# EAGLE design RGBLED (EAGLE 6.6.0)
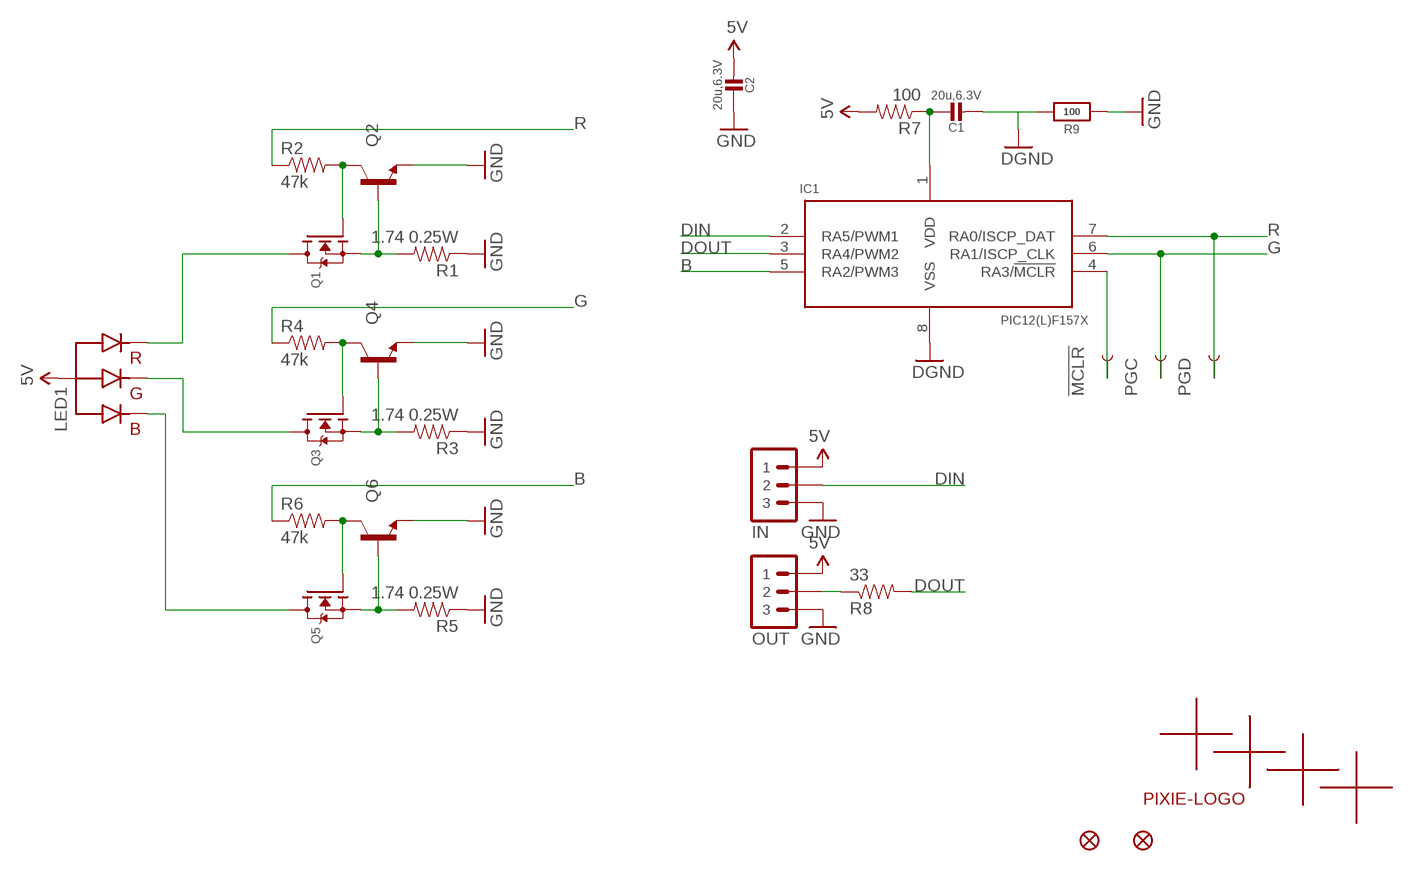
[diagram p0: schematic, sheet 1]

## Parts
!MCLR  TEST-POINT3X4  [PAD.03X.04]
C1  20u,6.3V  CAP_CERAMIC_0805MP  [_0805MP]
C2  20u,6.3V  CAP_CERAMIC_0805MP  [_0805MP]
IC1  PIC12(L)F157X  [MSOP-8]
IN  M030.1PWR+SIG  [1X03-0.1PWR+SIG]
LED1  RGBLED_CA  [RGBLED3W4PIN]
OUT  M030.1PWR+SIG  [1X03-0.1PWR+SIG]
PGC  TEST-POINT3X4  [PAD.03X.04]
PGD  TEST-POINT3X4  [PAD.03X.04]
Q1  IRLML2060TRPBF  [SOT23-3]
Q2  MMBT2222A  [SOT23-3]
Q3  IRLML2060TRPBF  [SOT23-3]
Q4  MMBT2222A  [SOT23-3]
Q5  IRLML2060TRPBF  [SOT23-3]
Q6  MMBT2222A  [SOT23-3]
R1  1.74 0.25W  RESISTOR1206  [1206]
R2  47k  RESISTOR0603  [0603-RES]
R3  1.74 0.25W  RESISTOR1206  [1206]
R4  47k  RESISTOR0603  [0603-RES]
R5  1.74 0.25W  RESISTOR1206  [1206]
R6  47k  RESISTOR0603  [0603-RES]
R7  100  RESISTOR0603  [0603-RES]
R8  33  RESISTOR0603  [0603-RES]
R9  100  RESISTOR_0603MP  [_0603MP]
U$1  ALIGN_CROSS  [ALIGN_CROSS]
U$2  ALIGN_CROSS  [ALIGN_CROSS]
U$3  ALIGN_CROSS  [ALIGN_CROSS]
U$4  ALIGN_CROSS  [ALIGN_CROSS]
U$5  PIXIE-LOGO  [PIXIE-LOGO]
U$6  FIDUCIAL""  [FIDUCIAL_1MM]
U$7  FIDUCIAL""  [FIDUCIAL_1MM]

## Nets
5V: C2.2 IN.P$1 LED1.ANODE(VCC) OUT.P$1 R7.2
B: IC1.5(RA2/PWM3) R6.1
DGND: C1.2 IC1.8(VSS) R9.2
DIN: IC1.2(RA5/PWM1) IN.P$2
DOUT: IC1.3(RA4/PWM2) R8.2
G: IC1.6(RA1/ISCP_CLK) PGC.P$1 R4.1
GND: C2.1 IN.P$3 OUT.P$3 Q2.2(E) Q4.2(E) Q6.2(E) R1.1 R3.1 R5.1 R9.1
N$1: LED1.R(RED) Q1.3(D)
N$2: LED1.G(GREEN) Q3.3(D)
N$3: LED1.B(BLUE) Q5.3(D)
N$4: Q1.2(S) Q2.1(B) R1.2
N$6: Q3.2(S) Q4.1(B) R3.2
N$8: OUT.P$2 R8.1
N$10: !MCLR.P$1 IC1.4(RA3/!MCLR)
N$11: Q5.1(G) Q6.3(C) R6.2
N$12: Q3.1(G) Q4.3(C) R4.2
N$13: C1.1 IC1.1(VDD) R7.1
N$15: Q5.2(S) Q6.1(B) R5.2
N$17: Q1.1(G) Q2.3(C) R2.2
R: IC1.7(RA0/ISCP_DAT) PGD.P$1 R2.1

## Library data of the parts
!MCLR PGC PGD = SparkFun-Passives:TEST-POINT: Bare copper test points for troubleshooting or ICT
C1 C2 = microbuilder:CAP_CERAMIC: Ceramic Capacitors For new designs, use the packages preceded by an '_' character since they are more reliable: The following footprints should be used on most boards: _0402 - Standard footprint for regular board layouts _0603 - Standard footprint for regular board layouts _0805 - Standard footprint for regular board layouts _1206 - Standard footprint for regular board layouts For extremely tight-pitch boards where space is at a premium, the following 'micro-pitch' footprints can be used (smaller pads, no silkscreen outline, etc.): _0402MP - Micro-pitch footprint for very dense/compact boards _0603MP - Micro-pitch footprint for very dense/compact boards _0805MP - Micro-pitch footprint for very dense/compact boards _1206MP - Micro-pitch footprint for very dense/compact boards
IC1 = microbuilder:PIC12(L)F157X
IN OUT = RGBLED:M03: Header 3 Standard 3-pin 0.1" header. Use with straight break away headers (SKU : PRT-00116), right angle break away headers (PRT-00553), swiss pins (PRT-00743), machine pins (PRT-00117), and female headers (PRT-00115). Molex polarized connector foot print use with SKU : PRT-08232 with associated crimp pins and housings.
LED1 = microbuilder:RGBLED_CA: RGB LED, common-anode 5MM Staggered pins 5mm Piranha package http://www.ladyada.net/library/pcb/eaglelibrary.html
Q1 Q3 Q5 = Parts:IRLML2060TRPBF
Q2 Q4 Q6 = Parts:MMBT2222A
R1 R3 R5 = SparkFun-Resistors:RESISTOR: Resistor Basic schematic elements and footprints for 0603, 1206, and PTH resistors.
R2 R4 R6-R8 = RGBLED:RESISTOR: Resistor Basic schematic elements and footprints for 0603, 1206, and PTH resistors.
R9 = microbuilder:RESISTOR: Resistors For new designs, use the packages preceded by an '_' character since they are more reliable: The following footprints should be used on most boards: _0402 - Standard footprint for regular board layouts _0603 - Standard footprint for regular board layouts _0805 - Standard footprint for regular board layouts _1206 - Standard footprint for regular board layouts For extremely tight-pitch boards where space is at a premium, the following 'micro-pitch' footprints can be used (smaller pads, no silkscreen outline, etc.): _0402MP - Micro-pitch footprint for very dense/compact boards _0603MP - Micro-pitch footprint for very dense/compact boards _0805MP - Micro-pitch footprint for very dense/compact boards _1206MP - Micro-pitch footprint for very dense/compact boards
U$1-U$4 = Parts:ALIGN_CROSS
U$5 = microbuilder:PIXIE-LOGO
U$6 U$7 = microbuilder:FIDUCIAL: Fiducial Alignment Points Various fiducial points for machine vision alignment.; BOM: EXCLUDE

## Board
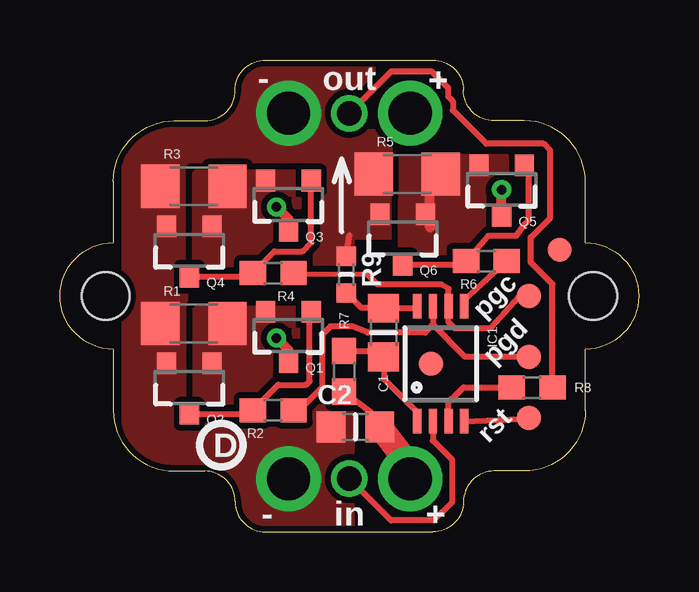
[diagram p1: board, top side]
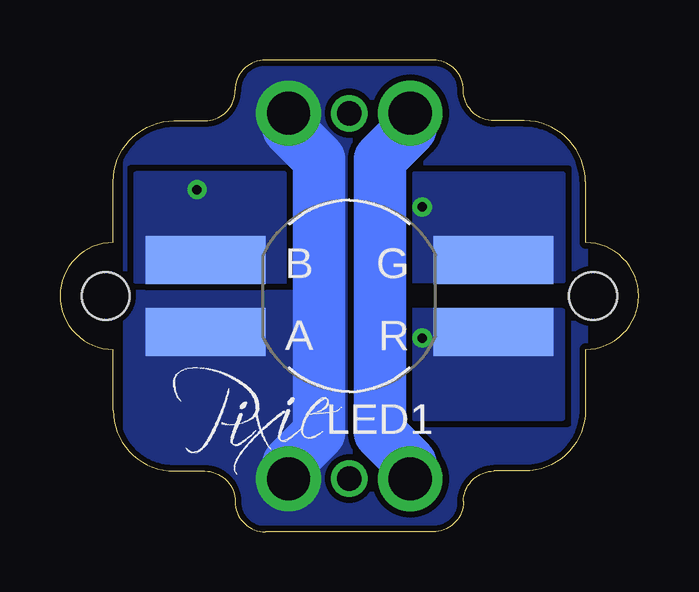
[diagram p2: board, bottom side, seen from below]

Size 24.13 x 19.69 mm. Coordinates in mm from the lower left corner, seen from the top.
Outline: 16.83,1.27 arc-90 15.56,0 8.57,0 arc-90 7.3,1.27 arc90 6.03,2.54 4.76,2.54 arc-90 2.22,5.08 2.22,7.62 arc-180 2.22,12.07 2.22,14.6 arc-90 4.76,17.14 6.03,17.14 arc90 7.3,18.42 arc-90 8.57,19.69 15.56,19.69 arc-90 16.83,18.42 arc90 18.1,17.14 19.37,17.14 arc-90 21.91,14.6 21.91,12.07 arc-180 21.91,7.62 21.91,5.08 arc-90 19.37,2.54 18.1,2.54 arc90 16.83,1.27
Copper layers (1*16): Top 0.035mm / dielectric 1.5mm / Bottom 0.035mm
Design rules "adafruit *": minimum track width 10mil, minimum drill 15.5mil, track to track 10mil, track to pad 10mil, pad to pad 10mil, via to via 10mil, smd to smd 8mil, copper to edge 10mil, drill to drill 8mil, minimum pad ring 10mil, minimum via ring 8mil, stop-mask expansion 2mil, vias tented up to drill 20mil, thermal gap 10mil
Holes 2 mm at 1.91,9.84 22.23,9.84

### Footprints (pad centres in the part's own frame; a part is rotated, then mirrored left to right if it is on the bottom)
PAD.03X.04 = smd 1.016 x 1.016: P$1 0,0
_0805MP = smd 1.2 x 1.3: 1 -1.016,0; 2 1.016,0
MSOP-8 = smd 0.35 x 1.02: 1 -0.975,-2.4; 2 -0.325,-2.4; 3 0.325,-2.4; 4 0.975,-2.4; 5 0.975,2.4; 6 0.325,2.4; 7 -0.325,2.4; 8 -0.975,2.4
1X03-0.1PWR+SIG = drill 1.8: P$1 -2.54,0; P$3 2.54,0 | drill 1.016: P$2 0,0
RGBLED3W4PIN = smd 5 x 2: ANODE 6,1.5; B 6,-1.5; G -6,-1.5; R -6,1.5
SOT23-3 = smd 0.8 x 0.9: 1 -0.95,-1; 2 0.95,-1; 3 0,1.1
1206 = smd 1.6 x 1.8: 1 -1.4,0; 2 1.4,0
0603-RES = smd 1.1 x 1: 1 -0.85,0; 2 0.85,0
_0603MP = smd 0.8 x 0.8: 1 -0.762,0; 2 0.762,0
FIDUCIAL_1MM = smd 1 x 1: 1 0,0

### Placement (x,y rotation side)
!MCLR  19.56,4.76 0 top
C1  13.49,8.32 90 top
C2  12.32,4.38 0 top
IC1  15.88,7.02 0 top
IN  12.06,2.22 180 top
LED1  12.06,9.84 180 bottom
OUT  12.06,17.46 180 top
PGC  19.56,9.84 0 top
PGD  19.56,7.3 0 top
Q1  9.53,8.19 180 top
Q2  5.4,6.03 180 top
Q3  9.53,13.65 180 top
Q4  5.4,11.75 180 top
Q5  18.42,14.29 180 top
Q6  14.29,12.26 180 top
R1  5.59,8.7 0 top
R2  8.89,5.08 180 top
R3  5.59,14.41 0 top
R4  8.89,10.79 180 top
R5  14.48,14.92 0 top
R6  17.78,11.3 180 top
R7  11.84,6.7 270 top
R8  19.69,6.03 180 top
R9  11.94,10.73 270 top
U$1  2.22,19.69 0 top
U$2  21.91,19.69 0 top
U$3  2.22,0 0 top
U$4  21.91,0 0 top
U$5  18.65,3.4 5 bottom
U$6  15.47,7.02 0 top
U$7  20.83,11.77 0 top
U$8  [PCBFEAT-REV-040]  6.73,3.62 0 top

### Tracks (layer width: path | path; a pad name or v marks a point on that pad's centre or on a via)
5V
  Top 0.254: C2.2 12.96,4.98 R7.2
  Top 1.016: C2.2 14.6,2.74 IN.P$1
  Bottom 2.184: IN.P$1 14.6,2.86 13.33,4.13 13.33,15.56 14.6,16.83 OUT.P$1
  pour Bottom (rank 6, no thermals): 2.22,19.69 21.4,19.69 21.4,0 2.22,0
B
  Top 0.254: IC1.5 16.85,9.65 R6.1
DGND
  Top 0.254: 14.88,9.52 IC1.8 14.9,9.35 C1.2 12.57,9.35 R9.2 11.94,9.82
DIN
  Top 0.254: IC1.2 15.55,3.82 16.34,3.02 16.34,1.24 15.58,0.48 13.8,0.48 IN.P$2
DOUT
  Top 0.254: IC1.3 16.2,5.41 16.83,6.03 R8.2
G
  Top 0.203: 12.83,10.73 9.8,10.73
  Top 0.254: PGC.P$1 19.18,9.84 17.96,8.5 16.46,8.5 16.19,8.76 16.19,9.54 IC1.6 16.2,10.15 15.9,10.33 13.23,10.33 12.83,10.73 | 9.74,10.77 R4.1 9.8,10.73
GND
  Top 0.254: R9.1 12.06,12.38
  Bottom 2.184: IN.P$3 9.53,2.86 10.79,4.13 10.79,15.56 9.53,16.83 OUT.P$3
  pour Top (rank 2, no thermals): 2.78,19.56 15.08,19.69 14.92,12.38 12.06,12.38 12.06,0 2.78,0.03
N$1  (via drill 0.39)
  Top 0.406: Q1.3 9.53,7.59 v9.03,8.09
  pour Bottom (no thermals): 3.17,9.21 11.11,9.21 11.11,4.76 3.17,4.76
N$2  (via drill 0.39)
  Top 0.406: Q3.3 9.53,13.06 v9.03,13.55
  pour Bottom (rank 2, no thermals): 3.17,10.48 11.11,10.48 11.11,14.92 3.17,14.92
N$3  (via drill 0.39)
  Top 0.406: Q5.3 v18.42,14.27
  pour Bottom (no thermals): 20.96,10.48 13.02,10.48 13.02,14.92 20.96,14.92
N$4
  Top 0.406: 6.71,8.17 R1.2
  pour Top (no thermals): 5.71,9.21 5.71,5.4 10.16,5.4 10.16,9.21
N$6
  pour Top (no thermals): 5.71,11.11 5.71,14.92 10.16,14.92 10.16,11.11
N$8
  Top 0.254: OUT.P$2 13.8,19.2 15.5,19.2 16.19,18.51 16.19,18.16 16.38,17.97 16.38,17.59 17.78,16.19 20.17,16.19 20.45,15.91 20.45,13.09 19.63,12.28 19.63,11.24 20.54,10.34 R8.1
N$10
  Top 0.254: IC1.4 19.67,4.74 !MCLR.P$1
N$11
  Top 0.254: Q6.3 16.78,11.16 R6.2 17.86,12.36 19.03,12.36 19.37,12.82 19.56,13.02 19.56,15.18 Q5.1
N$12
  Top 0.254: Q4.3 7.89,10.65 R4.2 8.94,11.7 10.11,11.7 10.47,12.06 Q3.1
N$13
  Top 0.254: R7.1 13.37,7.55 C1.1 13.5,6.39 14.86,5.04 14.86,4.64 IC1.1
N$15
  Top 0.406: 15.43,12.7 15.43,14.35 R5.2
  pour Top (no thermals): 14.29,15.56 14.29,11.75 19.05,11.75 19.05,15.56
N$17
  Top 0.254: Q2.3 7.89,4.93 R2.2 9.09,6.13 10.26,6.13 10.41,6.29 10.41,8.94 Q1.1
R
  Top 0.254: 9.89,5.08 R2.1 | 10.07,5.08 R2.1 | PGD.P$1 16.89,7.3 15.55,8.64 | IC1.7 15.55,8.64 | 15.55,8.64 15.22,8.32 12.83,8.32 12.19,8.57 11.28,8.57 10.92,8.22 10.92,6.03 9.97,5.08 R2.1

### Text on the board
tPlace: - | out | + | pgc | pgd | rst | - | in | +
_tNames: R3 | R3 | R4 | R4 | R5 | R5 | R6 | R6 | R8 | R8 | Q4 | Q4 | Q6 | Q6 | R1 | R1 | Q3 | Q3 | Q5 | Q5 | R2 | R2 | C1 | C1 | R7 | R7 | Q2 | Q2 | IC1 | IC1 | Q1 | Q1
_bNames: LED1 | LED1